# EAGLE design ProcesorPCB (EAGLE 7.7.0)
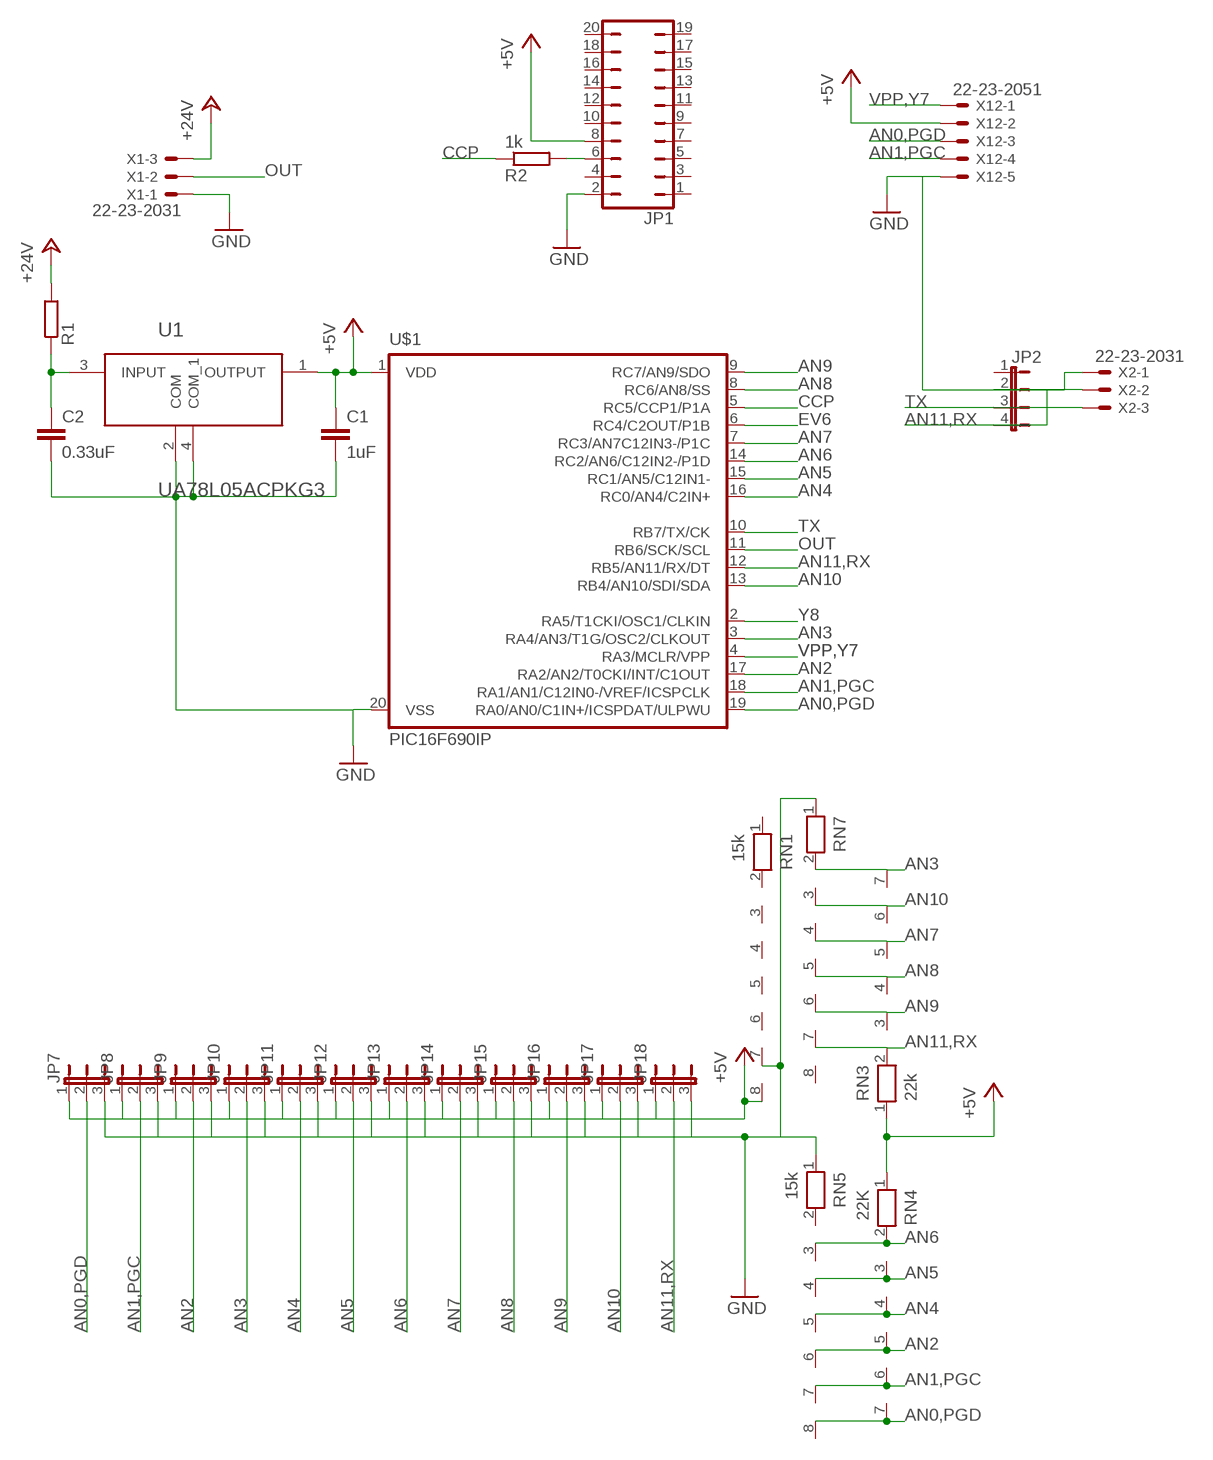
[diagram p0: schematic, sheet 1]

## Parts
C1  1uF  C-EU025-030X050  [C025-030X050]
C2  0.33uF  C-EU025-030X050  [C025-030X050]
JP1  JP10Q  [JP10Q]
JP2  JP4E  [JP4]
JP7  JP2E  [JP2]
JP8  JP2E  [JP2]
JP9  JP2E  [JP2]
JP10  JP2E  [JP2]
JP11  JP2E  [JP2]
JP12  JP2E  [JP2]
JP13  JP2E  [JP2]
JP14  JP2E  [JP2]
JP15  JP2E  [JP2]
JP16  JP2E  [JP2]
JP17  JP2E  [JP2]
JP18  JP2E  [JP2]
R1  R-EU_0207/10  [0207/10]
R2  1k  R-EU_0204/7  [0204/7]
RN1  15k  RN07  [RN-8]
RN3  22k  RN06  [RN-7]
RN4  22K  RN06  [RN-7]
RN5  15k  RN07  [RN-8]
RN7  RN07  [RN-8]
U1  UA78L05ACPKG3  [SOT150P400X160-4N]
U$1  PIC16F690IP  [DIL20]
X1  22-23-2031  [22-23-2031]
X2  22-23-2031  [22-23-2031]
X12  22-23-2051  [22-23-2051]

## Nets
+5V: C1.1 JP1.8 JP7.1 JP8.1 JP9.1 JP10.1 JP11.1 JP12.1 JP13.1 JP14.1 JP15.1 JP16.1 JP17.1 JP18.1 RN1.8 RN3.1 RN4.1 U1.1(OUTPUT) U$1.1(VDD) X12.2
+24V: R1.2 X1.3
AN0,PGD: JP7.2 RN4.7 U$1.19(RA0/AN0/C1IN+/ICSPDAT/ULPWU) X12.3
AN1,PGC: JP8.2 RN4.6 U$1.18(RA1/AN1/C12IN0-/VREF/ICSPCLK) X12.4
AN2: JP9.2 RN4.5 U$1.17(RA2/AN2/T0CKI/INT/C1OUT)
AN3: JP10.2 RN3.7 RN7.2 U$1.3(RA4/AN3/T1G/OSC2/CLKOUT)
AN4: JP11.2 RN4.4 U$1.16(RC0/AN4/C2IN+)
AN5: JP12.2 RN4.3 U$1.15(RC1/AN5/C12IN1-)
AN6: JP13.2 RN4.2 U$1.14(RC2/AN6/C12IN2-/P1D)
AN7: JP14.2 RN3.5 RN7.4 U$1.7(RC3/AN7C12IN3-/P1C)
AN8: JP15.2 RN3.4 RN7.5 U$1.8(RC6/AN8/SS)
AN9: JP16.2 RN3.3 RN7.6 U$1.9(RC7/AN9/SDO)
AN10: JP17.2 RN3.6 RN7.3 U$1.13(RB4/AN10/SDI/SDA)
AN11,RX: JP2.4 JP18.2 RN3.2 RN7.7 U$1.12(RB5/AN11/RX/DT) X2.2
CCP: R2.1 U$1.5(RC5/CCP1/P1A)
EV6: U$1.6(RC4/C2OUT/P1B)
GND: C1.2 C2.2 JP1.2 JP2.2 JP7.3 JP8.3 JP9.3 JP10.3 JP11.3 JP12.3 JP13.3 JP14.3 JP15.3 JP16.3 JP17.3 JP18.3 RN1.7 RN5.1 RN7.1 U1.2(COM) U1.4(COM_1) U$1.20(VSS) X1.1 X2.1 X12.5
N$2: C2.1 R1.1 U1.3(INPUT)
N$4: JP1.6 R2.2
OUT: U$1.11(RB6/SCK/SCL) X1.2
TX: JP2.3 U$1.10(RB7/TX/CK) X2.3
VPP,Y7: U$1.4(RA3/MCLR/VPP) X12.1
Y8: U$1.2(RA5/T1CKI/OSC1/CLKIN)
Unconnected: JP1.1 JP1.3 JP1.4 JP1.5 JP1.7 JP1.9 JP1.10 JP1.11 JP1.12 JP1.13 JP1.14 JP1.15 JP1.16 JP1.17 JP1.18 JP1.19 JP1.20 JP2.1 RN1.1 RN1.2 RN1.3 RN1.4 RN1.5 RN1.6 RN5.2 RN5.3 RN5.4 RN5.5 RN5.6 RN5.7 RN5.8 RN7.8

## Library data of the parts
C1 C2 = resistor:C-EU: CAPACITOR, European symbol
JP1 = jumper:JP10Q: JUMPER
JP2 = jumper:JP4E: JUMPER
JP7-JP18 = jumper:JP2E: JUMPER
R1 R2 = resistor:R-EU_: RESISTOR, European symbol
RN1 RN5 RN7 = resistor-net:RN07: RESISTOR NETWORK; OC_FARNELL: unknown; OC_NEWARK: unknown
RN3 RN4 = resistor-net:RN06: RESISTOR NETWORK; OC_FARNELL: unknown; OC_NEWARK: unknown
U1 = TI-Eagle_library:UA78L05: μA78L00 SERIES POSITIVE-VOLTAGE REGULATORS,SOT-89-3; MPN: UA78L05ACPKG3; OC_FARNELL: 1236590; OC_NEWARK: 13M5626; PACKAGE: SOT-89-3; SUPPLIER: TEXAS INSTRUMENTS
U$1 = microchip-5:PIC16F690*: MICROCONTROLLER PIC16F690 18 I/O One 16-bit timer Two 8-bit timer Two comparators Precision internal oscillator-software selectable 8 MHz - 32 KHz SSP w/ I2C Compatible Address mask option EUSART LIN 2.0 Compatible ECCP+ w/ PWM Steering 12 A/D Channels ULPW Enhanced Low Power Timer 1 Timer 1 Gate Synch Latch 4k Program Flash memory 256 bytes SRAM 256 bytes EEPROM
X1 X2 = con-molex:22-23-2031: .100" (2.54mm) Center Header - 3 Pin; MF: MOLEX; MPN: 22-23-2031; OC_FARNELL: 1462950; OC_NEWARK: 30C0862
X12 = con-molex:22-23-2051: .100" (2.54mm) Center Header - 5 Pin; MF: MOLEX; MPN: 22-23-2051; OC_FARNELL: 1462952; OC_NEWARK: 38C9178

## Board
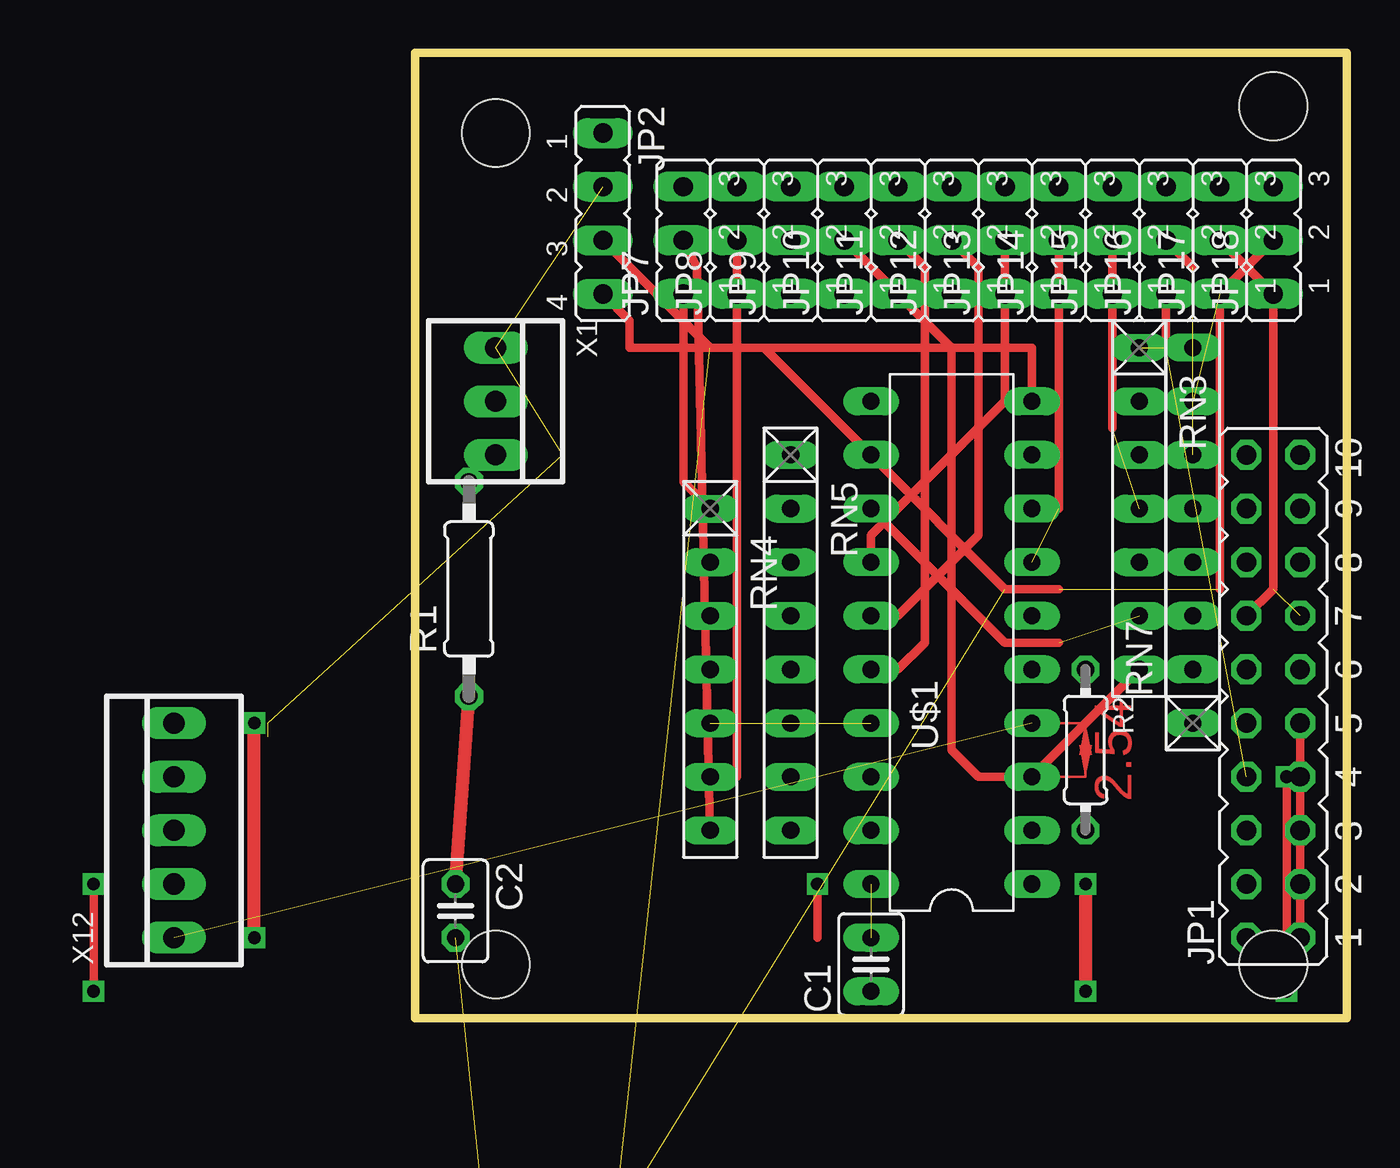
[diagram p1: board, top side]
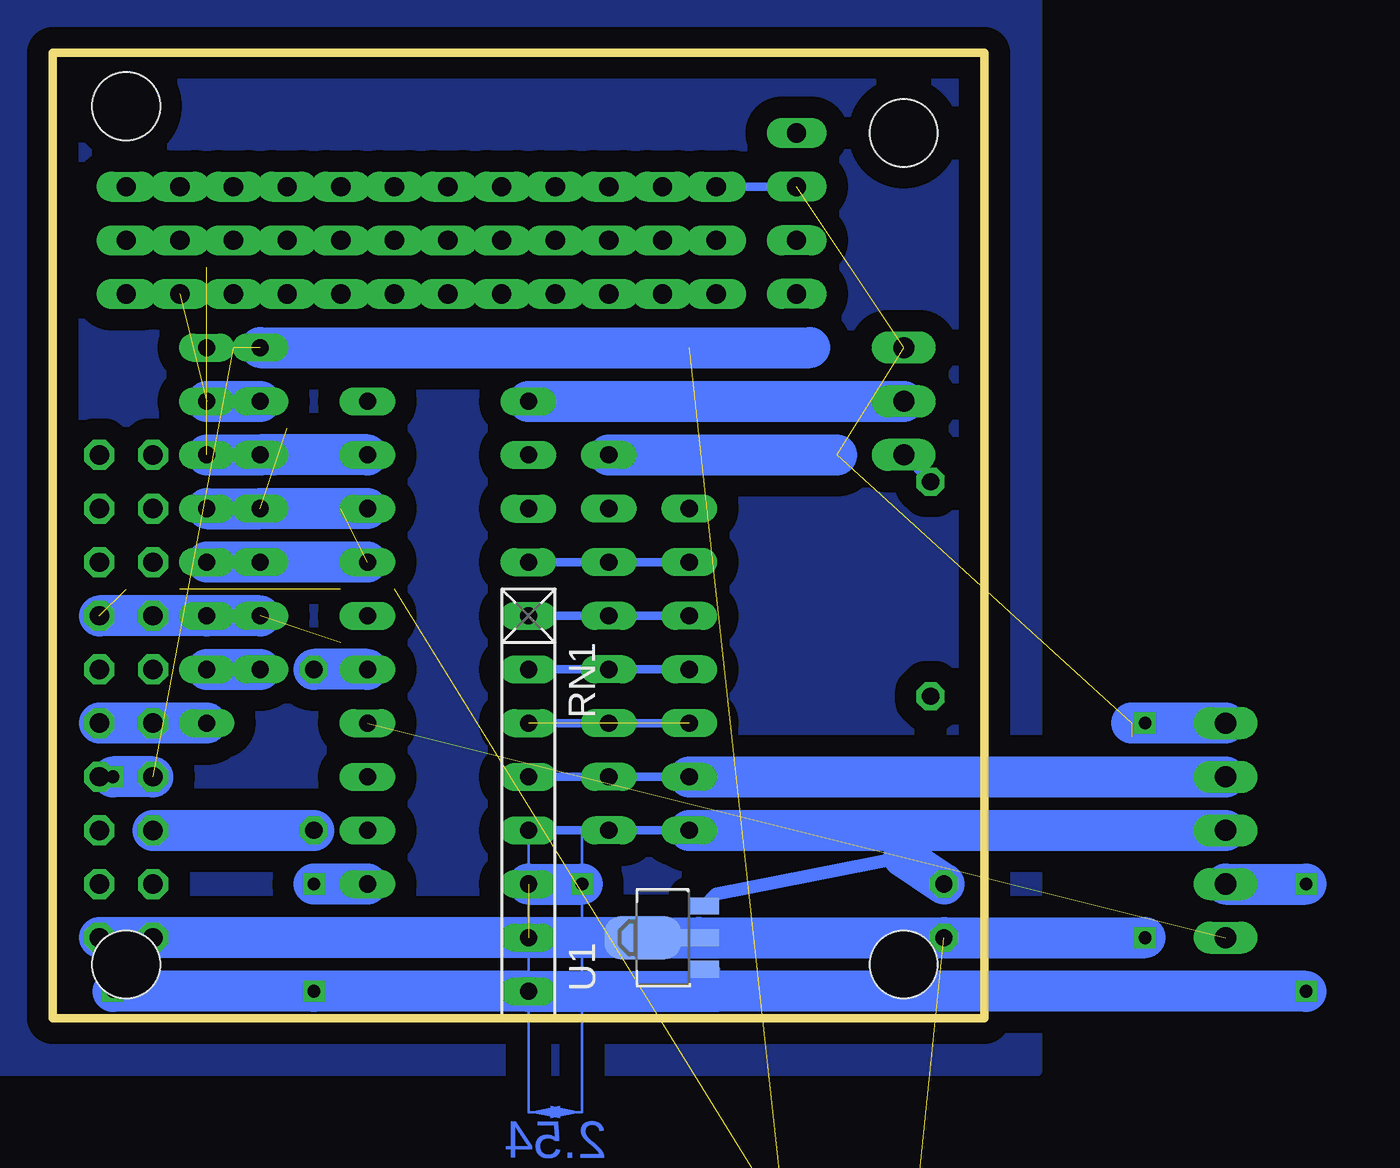
[diagram p2: board, bottom side, seen from below]

Size 44.12 x 45.71 mm. Coordinates in mm from the lower left corner, seen from the top.
Outline: 0,0 44.12,0 44.12,45.71 0,45.71 0,0
Copper layers (1*16): Top 0.035mm / dielectric 1.5mm / Bottom 0.035mm
Design rules "default": minimum track width 10mil, minimum drill 24mil, track to track 8mil, track to pad 8mil, pad to pad 8mil, via to via 8mil, smd to smd 8mil, copper to edge 40mil, drill to drill 8mil, minimum pad ring 10mil, minimum via ring 8mil, stop-mask expansion 4mil, vias tented up to drill 0mil, thermal gap 10mil
Holes 3.2 mm at 3.81,41.91 40.64,43.18 40.64,2.54 3.81,2.54

### Footprints (pad centres in the part's own frame; a part is rotated, then mirrored left to right if it is on the bottom)
C025-030X050 = drill 0.813 octagon: 1 -1.27,0; 2 1.27,0
JP10Q = drill 0.914 octagon: 1 -11.43,-1.27; 2 -11.43,1.27; 3 -8.89,-1.27; 4 -8.89,1.27; 5 -6.35,-1.27; 6 -6.35,1.27; 7 -3.81,-1.27; 8 -3.81,1.27; 9 -1.27,-1.27; 10 -1.27,1.27; 11 1.27,-1.27; 12 1.27,1.27; 13 3.81,-1.27; 14 3.81,1.27; 15 6.35,-1.27; 16 6.35,1.27; 17 8.89,-1.27; 18 8.89,1.27; 19 11.43,-1.27; 20 11.43,1.27
JP4 = drill 0.914 long: 1 -3.81,0; 2 -1.27,0; 3 1.27,0; 4 3.81,0
JP2 = drill 0.914 long: 1 -2.54,0; 2 0,0; 3 2.54,0
0207/10 = drill 0.813 octagon: 1 -5.08,0; 2 5.08,0
0204/7 = drill 0.813 octagon: 1 -3.81,0; 2 3.81,0
RN-8 = drill 0.813 long: 1 -8.89,0; 2 -6.35,0; 3 -3.81,0; 4 -1.27,0; 5 1.27,0; 6 3.81,0; 7 6.35,0; 8 8.89,0
RN-7 = drill 0.813 long: 1 -7.62,0; 2 -5.08,0; 3 -2.54,0; 4 0,0; 5 2.54,0; 6 5.08,0; 7 7.62,0
SOT150P400X160-4N = smd 0.8 x 1.4: 1 -1.499,-1.981; 3 1.499,-1.981 | smd 0.8 x 1.9: 2 0,-1.727 | smd 2.032 x 3.65: 4 0,0.94
DIL20 = drill 0.813 long: 1 -11.43,-3.81; 2 -8.89,-3.81; 3 -6.35,-3.81; 4 -3.81,-3.81; 5 -1.27,-3.81; 6 1.27,-3.81; 7 3.81,-3.81; 8 6.35,-3.81; 9 8.89,-3.81; 10 11.43,-3.81; 11 11.43,3.81; 12 8.89,3.81; 13 6.35,3.81; 14 3.81,3.81; 15 1.27,3.81; 16 -1.27,3.81; 17 -3.81,3.81; 18 -6.35,3.81; 19 -8.89,3.81; 20 -11.43,3.81
22-23-2031 = drill 1 long: 1 -2.54,0; 2 0,0; 3 2.54,0
22-23-2051 = drill 1 long: 1 -5.08,0; 2 -2.54,0; 3 0,0; 4 2.54,0; 5 5.08,0

### Placement (x,y rotation side)
C1  21.59,2.54 90 top
C2  1.91,5.08 270 top
JP1  40.64,15.24 90 top
JP2  8.89,38.1 270 top
JP7  12.7,36.83 90 top
JP8  15.24,36.83 90 top
JP9  17.78,36.83 90 top
JP10  20.32,36.83 90 top
JP11  22.86,36.83 90 top
JP12  25.4,36.83 90 top
JP13  27.94,36.83 90 top
JP14  30.48,36.83 90 top
JP15  33.02,36.83 90 top
JP16  35.56,36.83 90 top
JP17  38.1,36.83 90 top
JP18  40.64,36.83 90 top
R1  2.54,20.32 90 top
R2  31.75,12.7 270 top
RN1  21.59,10.16 270 bottom
RN3  34.29,24.13 270 top
RN4  13.97,16.51 270 top
RN5  17.78,17.78 270 top
RN7  36.83,22.86 90 top
U1  15.24,3.81 90 bottom
U$1  25.4,17.78 90 top
X1  3.81,29.21 270 top
X2  6.35,-14.61 0 top  (outside the outline)
X12  -11.43,8.89 90 top  (outside the outline)

### Tracks (layer width: path | path; a pad name or v marks a point on that pad's centre or on a via)
+5V  (via drill 0.6)  (2 unrouted)
  Top 0.406: RN4.1 12.7,25.4 JP7.1 | 35.56,31.75 JP16.1 | v41.28,11.43 v41.28,1.27 | v-15.24,6.35 v-15.24,1.27
  Top 0.61: v31.75,6.35 v31.75,1.27
  Bottom 0.406: JP7.1 JP8.1 JP9.1 JP10.1 JP11.1 JP12.1 JP13.1 JP14.1 JP15.1 JP16.1 JP17.1 JP18.1 | U1.1 12.7,2.31 12.7,1.27
  Bottom 1.93: v41.28,1.27 v31.75,1.27 RN1.8 12.7,1.27 v-15.24,1.27 | U$1.1 v31.75,6.35 | JP1.8 v41.28,11.43 | RN3.1 8.26,31.75 | X12.2 v-15.24,6.35
+24V
  Bottom 0.406: R1.2 X1.3
AN0,PGD
  Top 0.406: JP7.2 13.34,35.56 RN4.7
  Bottom 0.406: U$1.19 RN4.7
  Bottom 1.93: RN4.7 X12.3
AN1,PGC
  Top 0.406: JP8.2 15.24,11.43 RN4.6
  Bottom 0.406: U$1.18 RN4.6
  Bottom 1.93: RN4.6 X12.4
AN2  (1 unrouted)
  Bottom 0.406: U$1.17 RN4.5
AN3
  Top 0.406: JP10.2 25.4,31.75 25.4,12.7 26.67,11.43 U$1.3 RN3.7
  Bottom 1.93: RN7.2 RN3.7
AN4
  Top 0.406: JP11.2 24.13,35.56 24.13,17.78 22.86,16.51 U$1.16
  Bottom 0.406: U$1.16 RN4.4
AN5
  Top 0.406: JP12.2 26.67,35.56 26.67,22.86 22.86,19.05 U$1.15
  Bottom 0.406: U$1.15 RN4.3
AN6
  Top 0.406: JP13.2 27.94,29.21 21.59,22.86 U$1.14
  Bottom 0.406: U$1.14 RN4.2
AN7  (1 unrouted)
  Top 0.406: JP14.2 30.48,24.13
  Bottom 1.93: U$1.7 RN3.5 RN7.4
AN8  (1 unrouted)
  Top 0.406: JP15.2 33.02,27.94
  Bottom 1.93: U$1.8 RN3.4 RN7.5
AN9  (1 unrouted)
  Top 0.406: 36.83,35.56 JP16.2
  Bottom 1.93: U$1.9 33.66,26.67 RN3.3 RN7.6
AN10  (2 unrouted)
  Top 0.406: JP17.2 40.64,34.29 40.64,20.32 39.37,19.05 | 30.48,17.78 27.94,17.78 U$1.13
  Bottom 1.93: RN3.6 RN7.3 41.91,19.05
AN11,RX  (3 unrouted)
  Top 0.406: JP18.2 38.1,34.29 38.1,20.32 | 30.48,20.32 27.94,20.32 U$1.12 16.51,31.75 10.16,31.75 10.16,33.02 JP2.4
  Bottom 1.93: RN7.7 RN3.2
CCP
  Bottom 1.93: U$1.5 R2.1
GND  (via drill 0.6)  (6 unrouted)
  Top 0.406: v41.91,3.81 v41.91,13.97 | v19.05,6.35 19.05,3.81
  Top 0.61: v-7.62,3.81 v-7.62,13.97
  Bottom 0.406: JP18.3 JP17.3 JP16.3 JP15.3 JP14.3 JP13.3 JP12.3 JP11.3 JP10.3 JP9.3 JP8.3 JP7.3 JP2.2
  Bottom 1.93: v41.91,3.81 JP1.2 RN1.7 U1.4 U1.2 C2.2 v-7.62,3.81 | RN7.1 v41.91,13.97 | U$1.20 v19.05,6.35 | RN5.1 6.99,26.67 | X12.5 v-7.62,13.97 -6.98,13.97
N$1
  pour Bottom (isolate 1.016): -2.54,-2.54 -2.54,48.26 46.99,48.26 46.99,-2.54
N$2
  Top 0.61: C2.1 R1.1
  Bottom 0.61: 3.81,7.62 12.7,5.87 U1.3
  Bottom 1.93: C2.1 3.81,7.62
N$4
  Bottom 1.93: JP1.6 R2.2
OUT
  Bottom 1.93: U$1.11 X1.2
TX  (1 unrouted)
  Top 0.406: U$1.10 29.21,31.75 13.97,31.75 JP2.3
VPP,Y7  (1 unrouted)
(copper drawn outside any net)
  shapes: Bottom area x1, Top area x1